# Altium schematic sheet ESP-01S.SchDoc
size A4; SheetNumber: 4; SheetTotal: 6
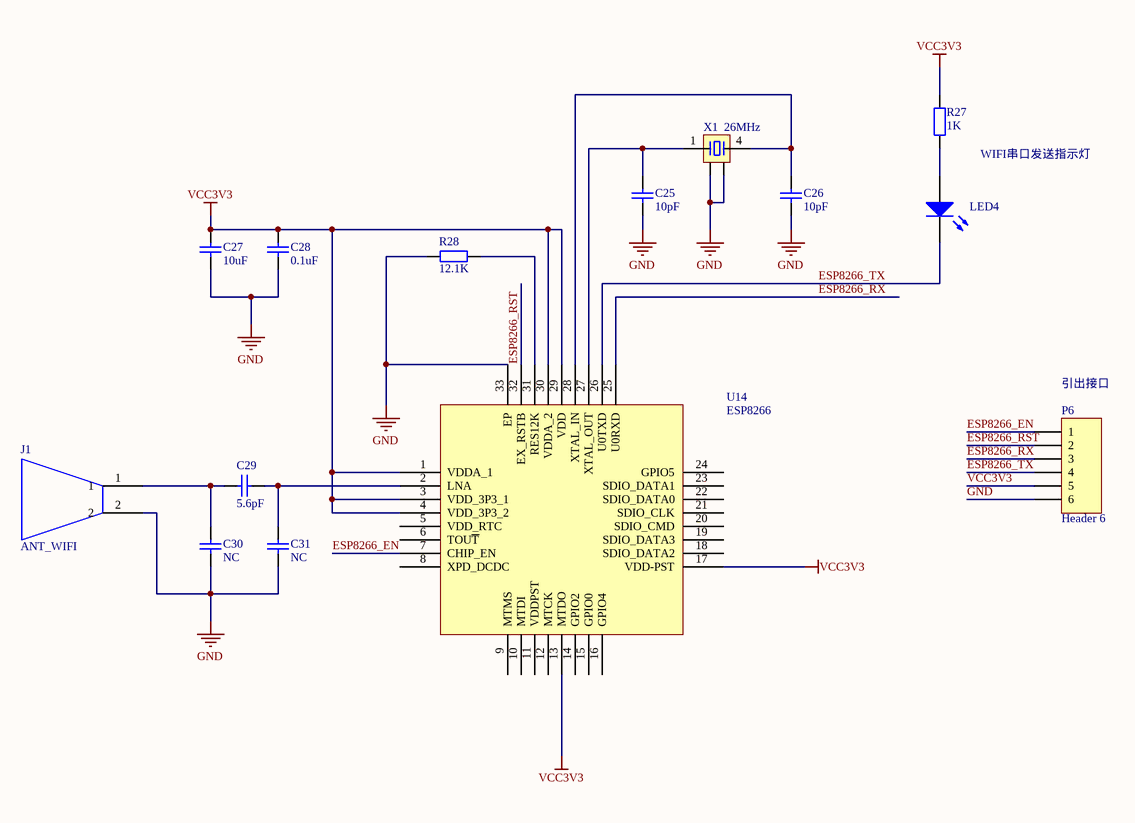
[diagram p0: ESP-01S.SchDoc]

## Parts
C25  10pF  [C0805_L]
C26  10pF  [C0805_L]
C27  10uF  [C0805_L]
C28  0.1uF  [C0805_L]
C29  5.6pF  [C0805_L]
C30  NC  [C0805_L]
C31  NC  [C0805_L]
J1  ANT_WIFI
LED4  红色  [LED0805_G]  (value not drawn)
P6  Header 6  [HDR1X6]
R27  1K  [R0805_L]
R28  12.1K  [R0805_L]
U14  ESP8266
X1  26MHz  [MC-146]

## Nets
GND: C25.1 C26.1 C27.1 C28.1 C30.1 C31.1 J1.2 P6.6 R28.1 U14.33(EP) X1.2 X1.3
VCC3V3: C27.2 C28.2 P6.5 R27.2 U14.1(VDDA_1) U14.3(VDD_3P3_1) U14.4(VDD_3P3_2) U14.13(MTDO) U14.17(VDD-PST) U14.29(VDD) U14.30(VDDA_2)
ESP8266_EN: P6.1 U14.7(CHIP_EN)
ESP8266_RST: P6.2 U14.32(EX_RSTB)
ESP8266_RX: P6.3 U14.25(U0RXD)
ESP8266_TX: LED4.2(K) P6.4 U14.26(U0TXD)
NetC25_2: C25.2 U14.27(XTAL_OUT) X1.1
NetC26_2: C26.2 U14.28(XTAL_IN) X1.4
NetC29_1: C29.1 C31.2 U14.2(LNA)
NetC29_2: C29.2 C30.2 J1.1
NetLED4_1: LED4.1(A) R27.1
NetR28_2: R28.2 U14.31(RES12K)

Not connected (* = marked no-connect by the designer): U14 5(VDD_RTC) 6(TOU~{T}) 8(XPD_DCDC) 9(MTMS) 10(MTDI) 11(VDDPST) 12(MTCK) 14(GPIO2) 15(GPIO0) 16(GPIO4) 18(SDIO_DATA2) 19(SDIO_DATA3) 20(SDIO_CMD) 21(SDIO_CLK) 22(SDIO_DATA0) 23(SDIO_DATA1) 24(GPIO5)

## Notes on the sheet
- WIFI串口发送指示灯
- (near P6) 引出接口

## Library data of the parts
C25-C31 = C: 贴片电容/MLCC电容; BOM名称: 无极性贴片电容; 联系下单店铺卖家 免费帮你查找封装: 联系下单店铺卖家 免费技术支持
LED4 = LED: 贴片LED; 封装库来自淘宝卖家：黄晶宝石: 其他店铺购入均为盗版封装库，无更新权益，退款现金奖励200~1000元; BOM名称: 贴片LED
P6 = Header 6: Header, 6-Pin; LatestRevisionDate: 17-Jul-2002; LatestRevisionNote: Re-released for DXP Platform.; Publisher: Altium Limited
R27 R28 = R: 贴片电阻; 当前库版本V2022.10.7 @黄晶宝石: 最新版本发布https://shop463601444.taobao.com; BOM名称: 贴片电阻
X1 = XTAL-MC-4P: MC系列4脚无源晶振(谐振器）; 当前库版本V2022.10.7 @黄晶宝石: 最新版本发布https://shop463601444.taobao.com; BOM名称: MC系列4脚无源晶振(谐振器）